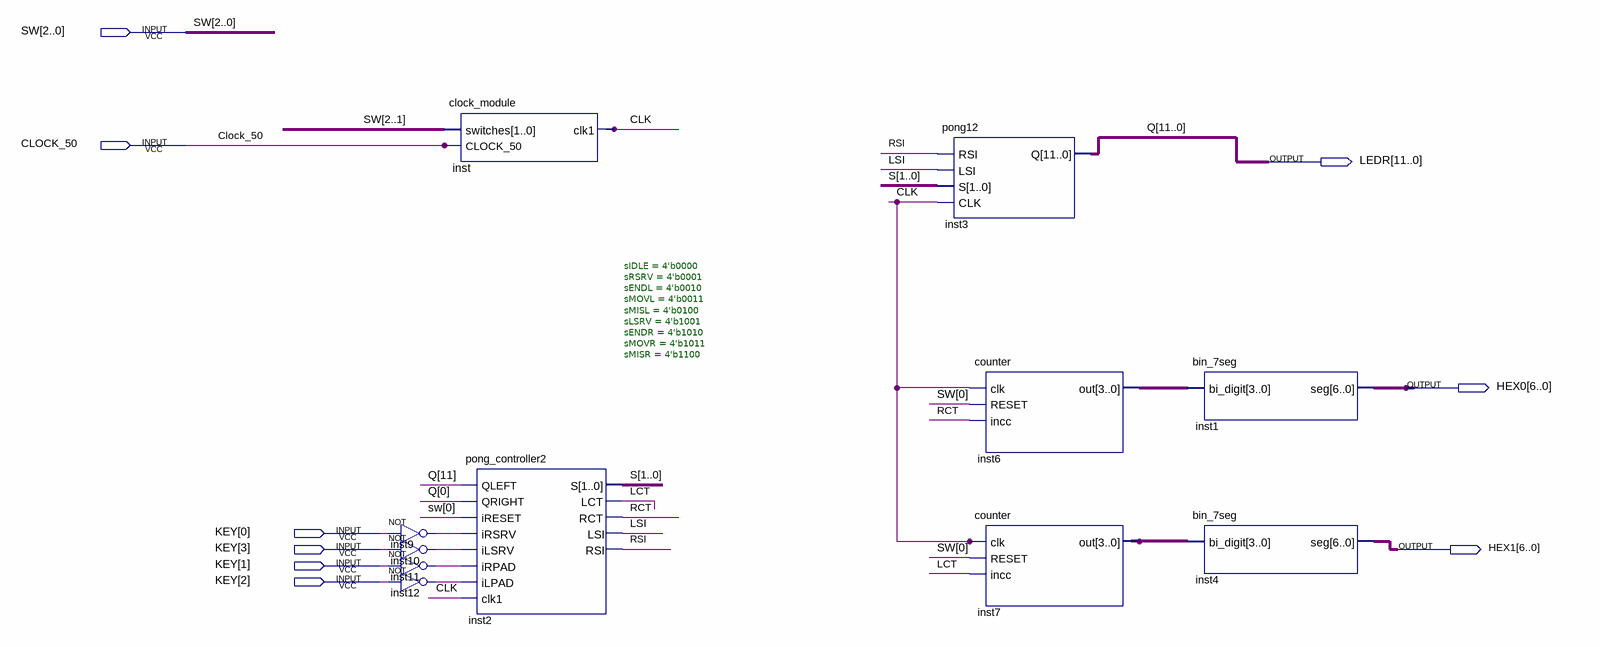
[diagram p0: schematic sheet]
// Quartus schematic Lab9.bdf as structural Verilog: 11 symbols, 9 pins
module Lab9 (
  input  [2:0] SW,
  input  CLOCK_50,
  input  [3:0] KEY,
  output [11:0] LEDR,
  output [6:0] HEX0,
  output [6:0] HEX1
);

  wire CLK, inst9_out, inst10_out, inst11_out, inst12_out, LCT, LSI, RCT, RSI;
  wire [1:0] S;
  wire [3:0] inst6_out, inst7_out;

  not inst9 (inst9_out, KEY[0]);
  not inst10 (inst10_out, KEY[3]);
  not inst11 (inst11_out, KEY[1]);
  not inst12 (inst12_out, KEY[2]);
  clock_module inst (.switches(SW[2:1]), .CLOCK_50(CLOCK_50), .clk1(CLK));
  pong_controller2 #(.sIDLE(4'b0000), .sRSRV(4'b0001), .sENDL(4'b0010), .sMOVL(4'b0011), .sMISL(4'b0100), .sLSRV(4'b1001), .sENDR(4'b1010), .sMOVR(4'b1011), .sMISR(4'b1100)) inst2 (
    .QLEFT(LEDR[11]), .QRIGHT(LEDR[0]), .iRESET(SW[0]), .iRSRV(inst9_out), .iLSRV(inst10_out),
    .iRPAD(inst11_out), .iLPAD(inst12_out), .clk1(CLK), .S(S), .LCT(LCT), .RCT(RCT), .LSI(LSI), .RSI(RSI));
  pong12 inst3 (.RSI(RSI), .LSI(LSI), .S(S), .CLK(CLK), .Q(LEDR));
  counter inst6 (.clk(CLK), .RESET(SW[0]), .incc(RCT), .out(inst6_out));
  counter inst7 (.clk(CLK), .RESET(SW[0]), .incc(LCT), .out(inst7_out));
  bin_7seg inst1 (.bi_digit(inst6_out), .seg(HEX0));
  bin_7seg inst4 (.bi_digit(inst7_out), .seg(HEX1));

  // Other names for the same wires on the sheet: Q[11:0] = LEDR
endmodule
